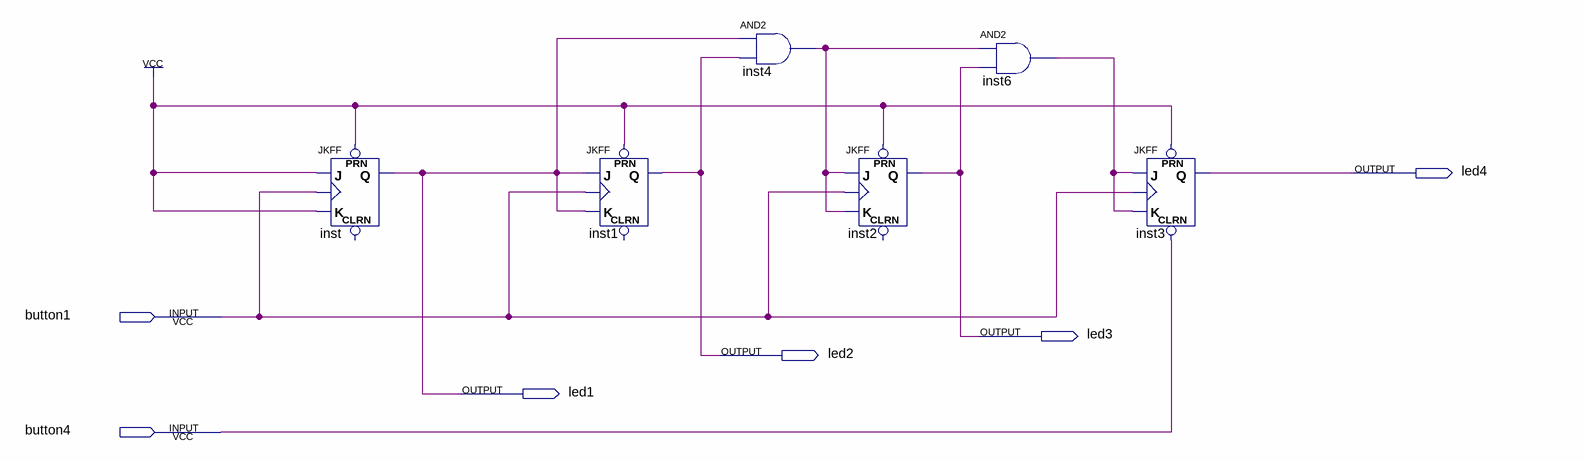
[diagram p0: schematic sheet]
// Quartus schematic Counter_4bit.bdf as structural Verilog: 6 symbols, 6 pins
module Counter_4bit (
  input  button1,
  input  button4,
  output led4,
  output led3,
  output led2,
  output led1
);

  wire inst4_out, inst6_out;

  JKFF inst (.PRN(1'b1), .K(1'b1), .J(1'b1), .CLK(button1), .Q(led1));  // open: CLRN
  JKFF inst1 (.PRN(1'b1), .K(led1), .J(led1), .CLK(button1), .Q(led2));  // open: CLRN
  and inst4 (inst4_out, led1, led2);
  JKFF inst2 (.PRN(1'b1), .K(inst4_out), .J(inst4_out), .CLK(button1), .Q(led3));  // open: CLRN
  and inst6 (inst6_out, inst4_out, led3);
  JKFF inst3 (.PRN(1'b1), .CLRN(button4), .K(inst6_out), .J(inst6_out), .CLK(button1), .Q(led4));
endmodule
